# Altium schematic sheet P16_USB 3.0 HUB.SchDoc
size 420 x 297 mm
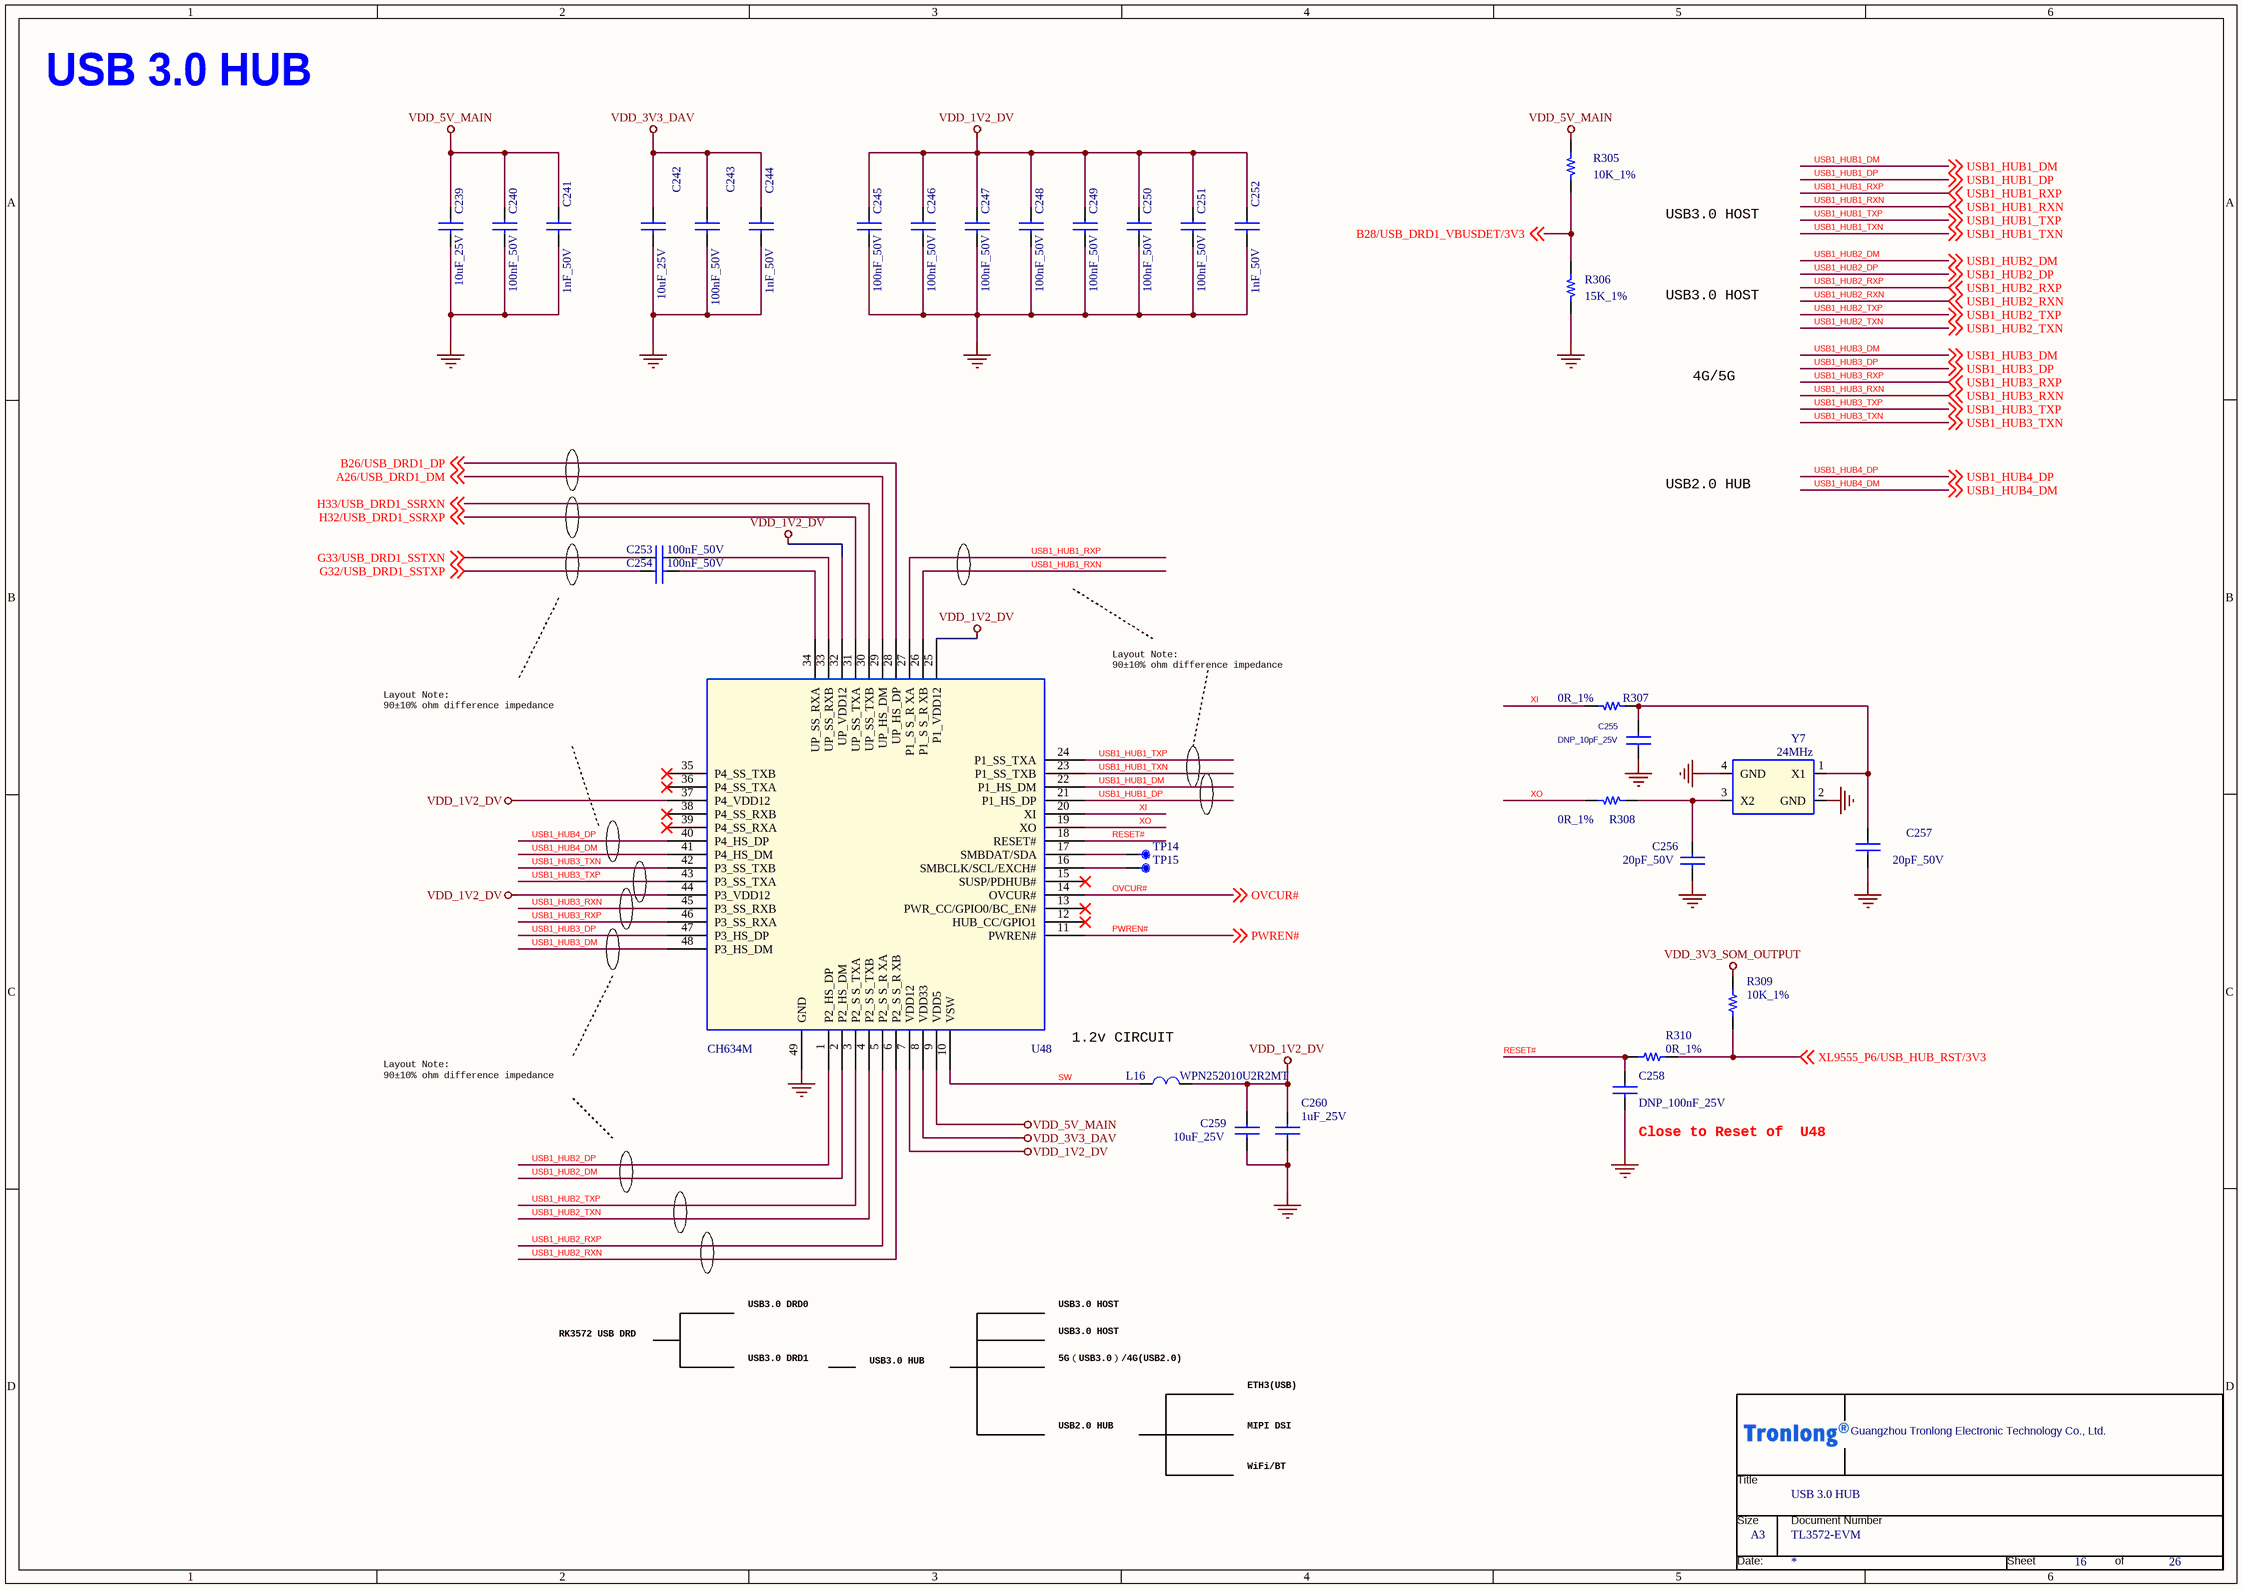
[diagram p0: P16_USB 3.0 HUB.SchDoc]

## Parts
*  Doc: TL3572-EVM  Title: USB 3.0 HUB  OrgName: Guangzhou Tronlong Electronic Technology Co., Ltd.  Page Size: A3  Page Number: 16  Page Count: 26  (hidden comment: Tronlong_TITTLE_20211115)  (graphical)
C239  10uF_25V  [C0603]
C240  100nF_50V  [C0402]
C241  1nF_50V  [C0402]
C242  10uF_25V  [C0603]
C243  100nF_50V  [C0402]
C244  1nF_50V  [C0402]
C245  100nF_50V  [C0402]
C246  100nF_50V  [C0402]
C247  100nF_50V  [C0402]
C248  100nF_50V  [C0402]
C249  100nF_50V  [C0402]
C250  100nF_50V  [C0402]
C251  100nF_50V  [C0402]
C252  1nF_50V  [C0402]
C253  100nF_50V  [C0402]
C254  100nF_50V  [C0402]
C255  DNP_10pF_25V  [C0402]
C256  20pF_50V  [C0402]
C257  20pF_50V  [C0402]
C258  DNP_100nF_25V  [C0402]
C259  10uF_25V  [C0603]
C260  1uF_25V  [C0402]
L16  WPN252010U2R2MT  [SMD-L2520M-2P]
R305  10K_1%  [R0402]
R306  15K_1%  [R0402]
R307  0R_1%  [R0402]
R308  0R_1%  [R0402]
R309  10K_1%  [R0402]
R310  0R_1%  [R0402]
TP14  SMT TP  [TP30]  (value not drawn)
TP15  SMT TP  [TP30]  (value not drawn)
U48  CH634M  [QFN48_5x5]
Y7  24MHz  [SMD_3225]

## Nets
GND: C239.2 C240.2 C241.2 C242.2 C243.2 C244.2 C245.2 C246.2 C247.2 C248.2 C249.2 C250.2 C251.2 C252.2 C255.1 C256.2 C257.2 C258.2 C259.2 C260.2 R306.2 U48.49(GND) Y7.2(GND) Y7.4(GND)
VDD_1V2_DV: C245.1 C246.1 C247.1 C248.1 C249.1 C250.1 C251.1 C252.1 C259.1 C260.1 L16.2 U48.7(VDD12) U48.25(P1_VDD12) U48.32(UP_VDD12) U48.37(P4_VDD12) U48.44(P3_VDD12)
VDD_3V3_DAV: C242.1 C243.1 C244.1 U48.8(VDD33)
VDD_3V3_SOM_OUTPUT: R309.1
VDD_5V_MAIN: C239.1 C240.1 C241.1 R305.1 U48.9(VDD5)
A26/USB_DRD1_DM: U48.29(UP_HS_DM) ; off-sheet A26/USB_DRD1_DM
B26/USB_DRD1_DP: U48.28(UP_HS_DP) ; off-sheet B26/USB_DRD1_DP
B28/USB_DRD1_VBUSDET/3V3: R305.2 R306.1 ; off-sheet B28/USB_DRD1_VBUSDET/3V3
G32/USB_DRD1_SSTXP: C254.1 ; off-sheet G32/USB_DRD1_SSTXP
G33/USB_DRD1_SSTXN: C253.1 ; off-sheet G33/USB_DRD1_SSTXN
H32/USB_DRD1_SSRXP: U48.31(UP_SS_TXA) ; off-sheet H32/USB_DRD1_SSRXP
H33/USB_DRD1_SSRXN: U48.30(UP_SS_TXB) ; off-sheet H33/USB_DRD1_SSRXN
OVCUR#: U48.14(OVCUR#) ; off-sheet OVCUR#
PWREN#: U48.11(PWREN#) ; off-sheet PWREN#
RESET#: C258.1 R310.2 U48.18(RESET#)
SW: L16.1 U48.10(VSW)
USB1_HUB1_DM: U48.22(P1_HS_DM) ; off-sheet USB1_HUB1_DM
USB1_HUB1_DP: U48.21(P1_HS_DP) ; off-sheet USB1_HUB1_DP
USB1_HUB1_RXN: U48.26(P1_S_S_R_XB) ; off-sheet USB1_HUB1_RXN
USB1_HUB1_RXP: U48.27(P1_S_S_R_XA) ; off-sheet USB1_HUB1_RXP
USB1_HUB1_TXN: U48.23(P1_SS_TXB) ; off-sheet USB1_HUB1_TXN
USB1_HUB1_TXP: U48.24(P1_SS_TXA) ; off-sheet USB1_HUB1_TXP
USB1_HUB2_DM: U48.2(P2_HS_DM) ; off-sheet USB1_HUB2_DM
USB1_HUB2_DP: U48.1(P2_HS_DP) ; off-sheet USB1_HUB2_DP
USB1_HUB2_RXN: U48.6(P2_S_S_R_XB) ; off-sheet USB1_HUB2_RXN
USB1_HUB2_RXP: U48.5(P2_S_S_R_XA) ; off-sheet USB1_HUB2_RXP
USB1_HUB2_TXN: U48.4(P2_S_S_TXB) ; off-sheet USB1_HUB2_TXN
USB1_HUB2_TXP: U48.3(P2_S_S_TXA) ; off-sheet USB1_HUB2_TXP
USB1_HUB3_DM: U48.48(P3_HS_DM) ; off-sheet USB1_HUB3_DM
USB1_HUB3_DP: U48.47(P3_HS_DP) ; off-sheet USB1_HUB3_DP
USB1_HUB3_RXN: U48.45(P3_SS_RXB) ; off-sheet USB1_HUB3_RXN
USB1_HUB3_RXP: U48.46(P3_SS_RXA) ; off-sheet USB1_HUB3_RXP
USB1_HUB3_TXN: U48.42(P3_SS_TXB) ; off-sheet USB1_HUB3_TXN
USB1_HUB3_TXP: U48.43(P3_SS_TXA) ; off-sheet USB1_HUB3_TXP
USB1_HUB4_DM: U48.41(P4_HS_DM) ; off-sheet USB1_HUB4_DM
USB1_HUB4_DP: U48.40(P4_HS_DP) ; off-sheet USB1_HUB4_DP
XI: R307.2 U48.20(XI)
XL9555_P6/USB_HUB_RST/3V3: R309.2 R310.1 ; off-sheet XL9555_P6/USB_HUB_RST/3V3
XO: R308.2 U48.19(XO)
NetC253_2: C253.2 U48.33(UP_SS_RXB)
NetC254_2: C254.2 U48.34(UP_SS_RXA)
NetC255_2: C255.2 C257.1 R307.1 Y7.1(X1)
NetC256_1: C256.1 R308.1 Y7.3(X2)
NetTP14_1: TP14.1 U48.17(SMBDAT/SDA)
NetTP15_1: TP15.1 U48.16(SMBCLK/SCL/EXCH#)

Not connected (* = marked no-connect by the designer): U48 12(HUB_CC/GPIO1)* 13(PWR_CC/GPIO0/BC_EN#)* 15(SUSP/PDHUB#)* 35(P4_SS_TXB)* 36(P4_SS_TXA)* 38(P4_SS_RXB)* 39(P4_SS_RXA)*

## Notes on the sheet
- USB 3.0 HUB
- USB3.0 HOST
- 4G/5G
- USB2.0 HUB
- (near U48) Layout Note:
  90±10% ohm difference impedance
- Layout Note:
  90±10% ohm difference impedance
- 1.2v CIRCUIT
- (near C258) Close to Reset of  U48
- RK3572 USB DRD
- USB3.0 DRD0
- USB3.0 DRD1
- USB3.0 HUB
- 5G（USB3.0）/4G(USB2.0)
- ETH3(USB)
- MIPI DSI
- WiFi/BT
- (in symbol Tronlong_TITTLE_20211115) Title; Size; Document Number; Date:; Sheet; of

## Library data of the parts
* = Tronlong_TITTLE_20211115: RevCode: A?; Page Create Date: March  8, 1995; Page Modify Date: *
C239 = CAP NP_Dup2: 贴片陶瓷电容,10uF,20%,25V,X5R; Manufacturer: 广东风华高新科技股份有限公司（FH）; Manufacturer Character: 中国大陆; Manufacturer PartNumber: 0603X106M250NT; Eco-Label: ROHS; ERP Number: 005.0001.0001.00527; Operation Temperature（℃）: -55~+85(Ta); As-Welded: /; PCB Footprint: C0603; Part Status: 优选
C240 C243 C254 = CAP NP_Dup2: 贴片陶瓷电容,100nF,10%,50V,X7R; Manufacturer PartNumber: 0402B104K500NT; Manufacturer Character: 中国大陆; Manufacturer: 广东风华高新科技股份有限公司（FH）; As-Welded: /; Operation Temperature（℃）: -55~+125(Ta); ERP Number: 005.0001.0001.00681; Eco-Label: ROHS; PCB Footprint: C0402; Part Status: 试用
C241 = CAP NP_1: 贴片陶瓷电容,1nF,10%,50V,X7R; Manufacturer PartNumber: 0402B102K500NT; Manufacturer Character: 中国大陆; Manufacturer PN: GRM153R61A105ME95; Manufacturer: 广东风华高新科技股份有限公司（FH）; Eco-Label: ROHS; Operation Temperature（℃）: -55~+125(Ta); Tolerance: ±20%; Priority: A; RK PN: 902003368; As-Welded: /; ERP Number: 005.0001.0001.00523; Part Status: 优选; Created by: JJJ; Part Type: 一般用片状陶瓷电容
C242 C259 = CAP NP_Dup2: 贴片陶瓷电容,10uF,20%,25V,X5R; Manufacturer PartNumber: 0603X106M250NT; Manufacturer Character: 中国大陆; Manufacturer: 广东风华高新科技股份有限公司（FH）; As-Welded: /; Operation Temperature（℃）: -55~+85(Ta); ERP Number: 005.0001.0001.00527; Eco-Label: ROHS; PCB Footprint: C0603; Part Status: 优选
C244 = CAP NP_1: 贴片陶瓷电容,1nF,10%,50V,X7R; Manufacturer PartNumber: 0402B102K500NT; Manufacturer Character: 中国大陆; Manufacturer PN: GRM153R61A105ME95; Manufacturer: 广东风华高新科技股份有限公司（FH）; Operation Temperature（℃）: -55~+125(Ta); Tolerance: ±20%; Priority: A; RK PN: 902003368; As-Welded: /; ERP Number: 005.0001.0001.00523; Eco-Label: ROHS; Part Status: 优选; Created by: JJJ; Part Type: 一般用片状陶瓷电容
C245-C251 = CAP NP_Dup2: 贴片陶瓷电容,100nF,10%,50V,X7R; Manufacturer PartNumber: 0402B104K500NT; Manufacturer Character: 中国大陆; Manufacturer: 广东风华高新科技股份有限公司（FH）; As-Welded: /; Operation Temperature（℃）: -55~+125(Ta); xGLA pn: 10-00005-01; ERP Number: 005.0001.0001.00681; Eco-Label: ROHS; PCB Footprint: C0402; Part Status: 试用
C252 = CAP NP_1: 贴片陶瓷电容,1nF,10%,50V,X7R; Manufacturer: 广东风华高新科技股份有限公司（FH）; Manufacturer PN: GRM153R61A105ME95; Manufacturer Character: 中国大陆; Manufacturer PartNumber: 0402B102K500NT; ERP Number: 005.0001.0001.00523; As-Welded: /; RK PN: 902003368; Priority: A; Tolerance: ±20%; Operation Temperature（℃）: -55~+125(Ta); Eco-Label: ROHS; Part Type: 一般用片状陶瓷电容; Created by: JJJ; Part Status: 优选
C253 = CAP NP_Dup2: 贴片陶瓷电容,100nF,10%,50V,X7R; Manufacturer: 广东风华高新科技股份有限公司（FH）; Manufacturer PartNumber: 0402B104K500NT; Manufacturer Character: 中国大陆; Eco-Label: ROHS; ERP Number: 005.0001.0001.00681; Operation Temperature（℃）: -55~+125(Ta); As-Welded: /; PCB Footprint: C0402; Part Status: 试用
C255 = CAP NP_Dup3: CL05C100JA5NNNC; Manufacturer PartNumber: 10pF,5%,C0402,25V,（X7R,X5R,COG,NPO或X7S）; Manufacturer: 广州创龙; As-Welded: DNP; Operation Temperature（℃）: -40~+85(Ta); ERP Number: 005.0001.0022.00030; Eco-Label: ROHS; PCB Footprint: C0402; Temperature: -55~125℃; Manufacturer Character: -; Part Status: -
C256 C257 = CAP NP_Dup2: 贴片陶瓷电容,20pF,5%,50V,COG; Manufacturer: 广东风华高新科技股份有限公司（FH）; Manufacturer Character: 中国大陆; Manufacturer PartNumber: 0402CG200J500NT; Eco-Label: ROHS; ERP Number: 005.0001.0001.00678; xGLA pn: 10-00005-01; Operation Temperature（℃）: -55~+125(Ta); As-Welded: /; PCB Footprint: C0402; Part Status: 试用
C258 = CAP NP_Dup1: 贴片陶瓷电容,100nF,10%,25V,X7R; Manufacturer PN: C1005X5R1A104K050BA; Manufacturer: 广东风华高新科技股份有限公司（FH）; Manufacturer Character: 中国大陆; Manufacturer PartNumber: 0402B104K250NT; ERP Number: 005.0001.0001.00518; As-Welded: DNP; Operation Temperature（℃）: -55~+125(Ta); Priority: A; Eco-Label: ROHS; PCB Footprint: C0402; Created by: JJJ; Tolerance: 10%; Part Type: C0402; RK PN: C1005X5R1A104K050BA; Part Status: 优选
C260 = CAP NP_1: 贴片陶瓷电容,1uF,10%,25V,X5R; Manufacturer Character: 中国大陆; Manufacturer PN: GRM153R61A105ME95; Manufacturer: 广东风华高新科技股份有限公司（FH）; Manufacturer PartNumber: 0402X105K250NT; ERP Number: 005.0001.0001.00640; Operation Temperature（℃）: -55~+85(Ta); Tolerance: ±20%; Priority: A; RK PN: 902003368; As-Welded: /; Eco-Label: ROHS; Part Status: 试用; Created by: JJJ; Part Type: 一般用片状陶瓷电容
L16 = FB-0805: 贴片功率电感,2.2uH,0.096Ω,Isat=2.9A,Irms=2.4A; Manufacturer Character: 中国大陆; Manufacturer: 深圳顺络电子股份有限公司（Sunlord）; As-Welded: /; Operation Temperature（℃）: -40~+125(Ta); PCB Footprint: SMD-L2520M-2P; Temperature: -40~125; Manufacturer PartNumber: WPN252010U2R2MT
R305 = Resistor_Dup3: 贴片电阻,10K,±1%,1/16W; Manufacturer Character: 中国大陆; Manufacturer: 广东风华高新科技股份有限公司（FH）; Manufacturer PartNumber: RC-02K1002FT; CLASS: DISCRETE; Eco-Label: ROHS; ERP Number: 005.0001.0002.01326; Operation Temperature（℃）: -55~+125(Ta); room: USB HUB; As-Welded: /; PCB Footprint: R0402; Part Status: 优选; Temperature: -55~155℃; ERP PCB Footprint: R0402
R306 = Resistor_Dup3: 贴片电阻,15K,±1%,1/16W; Manufacturer PartNumber: RC-02K1502FT; Manufacturer: 广东风华高新科技股份有限公司（FH）; Manufacturer Character: 中国大陆; CLASS: DISCRETE; As-Welded: /; Operation Temperature（℃）: -55~+155(Ta); room: USB HUB; ERP Number: 005.0001.0002.01309; Eco-Label: ROHS; PCB Footprint: R0402; Part Status: 试用; Temperature: -55~155℃; ERP PCB Footprint: R0402
R307 R308 = Resistor_Dup1: 贴片电阻,0R,±1%,1/16W; Manufacturer PartNumber: RC-02000FT; Manufacturer Character: 中国大陆; Manufacturer PN: RC0201JR-070RL; Manufacturer: 广东风华高新科技股份有限公司（FH）; CLASS: DISCRETE; Eco-Label: ROHS; ERP Number: 005.0001.0002.00938; Operation Temperature（℃）: -55~+155(Ta); Wattage: 1/20W; Tolerance: 5%; Priority: A; RK PN: 901000473; As-Welded: /; PCB Footprint: R0402; Created by: YTL; Part Type: 通用厚膜电阻; Part Status: 优选
R309 = Resistor_Dup3: 贴片电阻,10K,±1%,1/16W; Manufacturer PartNumber: RC-02K1002FT; Manufacturer Character: 中国大陆; Manufacturer: 广东风华高新科技股份有限公司（FH）; CLASS: DISCRETE; Operation Temperature（℃）: -55~+125(Ta); As-Welded: /; ERP Number: 005.0001.0002.01326; Eco-Label: ROHS; PCB Footprint: R0402; Part Status: 优选
R310 = Resistor_Dup3: 贴片电阻,0R,±1%,1/16W; Manufacturer PartNumber: RC-02000FT; Manufacturer Character: 中国大陆; Manufacturer: 广东风华高新科技股份有限公司（FH）; CLASS: DISCRETE; As-Welded: /; Operation Temperature（℃）: -55~+155(Ta); ERP Number: 005.0001.0002.00938; Eco-Label: ROHS; PCB Footprint: R0402; Part Status: 优选
TP14 TP15 = TP-S40: /; Manufacturer Character: 中国大陆; Characteristic: Test point,diameter=1.0mm; As-Welded: DNP; PCB Footprint: TP30; Operation Temperature（℃）: /; Manufacturer: /; Manufacturer PartNumber: /
U48 = CH634M_0: USB 3.2 Gen1 HUB控制器; Manufacturer Character: 中国大陆; Manufacturer: 南京沁恒微电子股份有限公司（WCH）; Eco-Label: ROHS; Operation Temperature（℃）: -40~+85(Ta); As-Welded: /; ERP Number: 005.0001.0004.01286; PCB Footprint: QFN48_5x5; Manufacturer PartNumber: CH634M; Part Status: 测评
Y7 = CRYSTAL_4P: 四脚无源晶振,24MHz,±10ppm,12pF,100Ω,±30ppm; Manufacturer: 深圳市星通时频电子有限公司（SCTF）; Manufacturer Character: 中国大陆; Manufacturer PartNumber: S3B24.000F1210F30; As-Welded: /; RK PN: E3SB24.0000F08E11; Priority: A; Operation Temperature（℃）: -40~+85(Ta); ERP Number: 005.0001.0005.00122; Eco-Label: ROHS; Part Status: 试用; Part Type: CRYSTAL; Manufacturer PN: E3SB24.0000F08E11; Created by: JJJ